# Altium project Commutator_DWS.PrjPcb
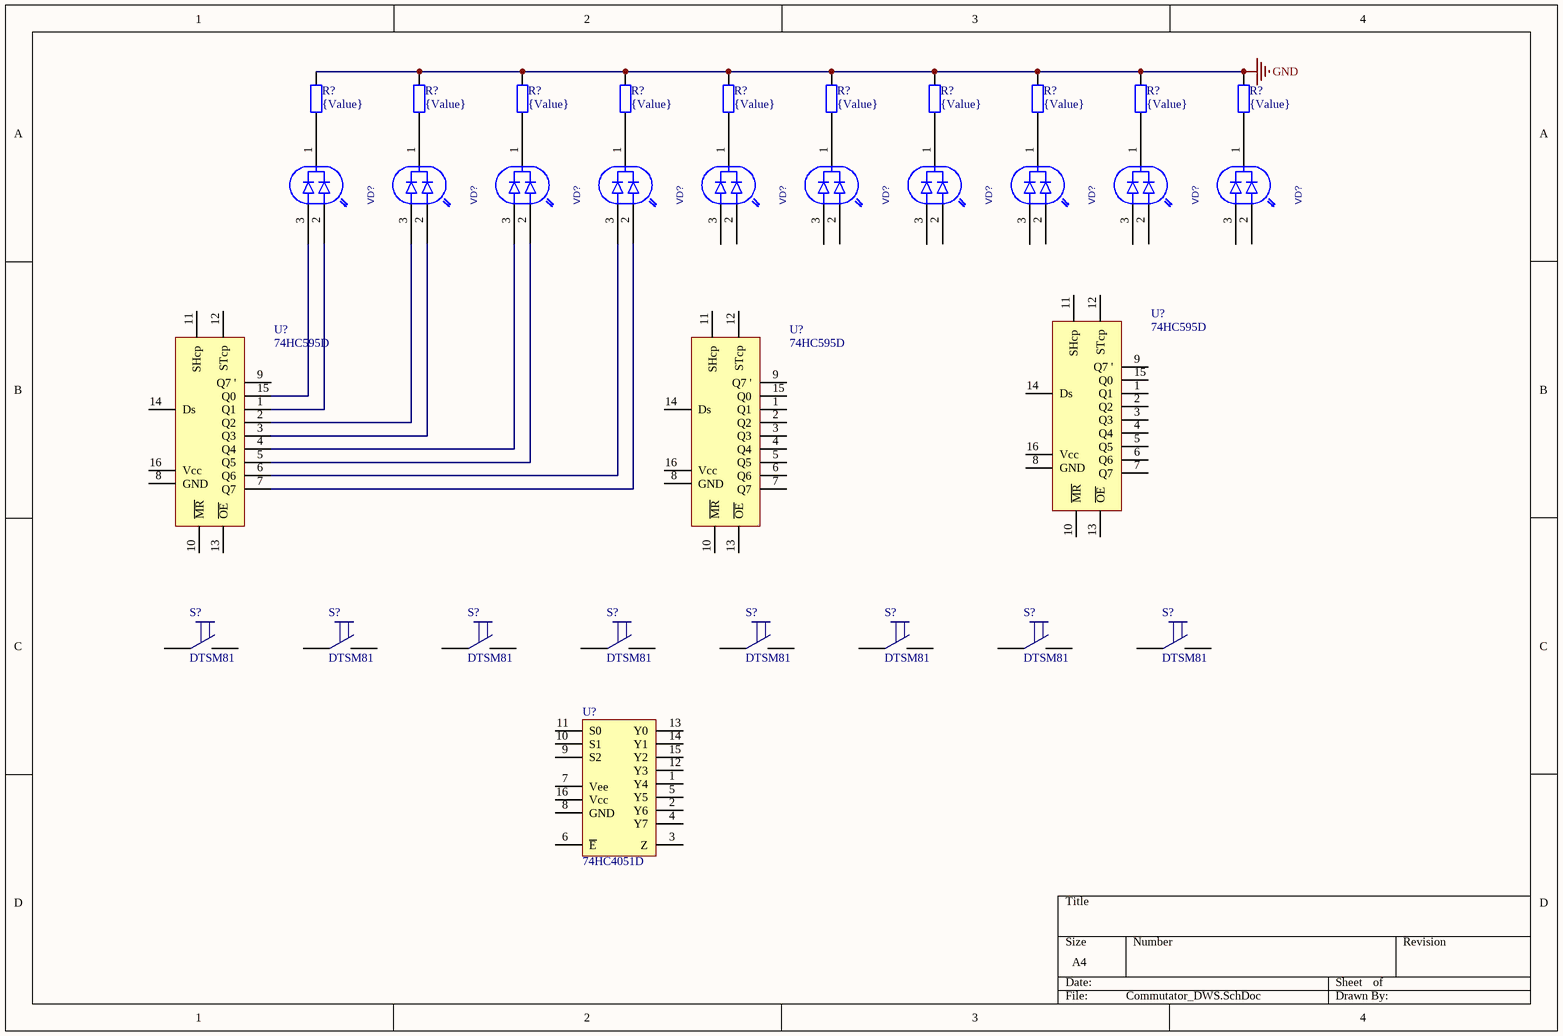
[diagram p0: Commutator_DWS.SchDoc]
1 sheet, 32 parts. Net scope: global (net labels, ports and power ports of the same name join across sheets).

## Sheet Commutator_DWS.SchDoc
size A4

### Parts
(Parts that share a designator on the sheet are numbered #1, #2 ... from top to bottom, then left to right.)
R?#1  value {Value}  [C0805]  (hidden comment: RES)
R?#2  value {Value}  [C0805]  (hidden comment: RES)
R?#3  value {Value}  [C0805]  (hidden comment: RES)
R?#4  value {Value}  [C0805]  (hidden comment: RES)
R?#5  value {Value}  [C0805]  (hidden comment: RES)
R?#6  value {Value}  [C0805]  (hidden comment: RES)
R?#7  value {Value}  [C0805]  (hidden comment: RES)
R?#8  value {Value}  [C0805]  (hidden comment: RES)
R?#9  value {Value}  [C0805]  (hidden comment: RES)
R?#10  value {Value}  [C0805]  (hidden comment: RES)
S?#1  DTSM81  [DTSM81]
S?#2  DTSM81  [DTSM81]
S?#3  DTSM81  [DTSM81]
S?#4  DTSM81  [DTSM81]
S?#5  DTSM81  [DTSM81]
S?#6  DTSM81  [DTSM81]
S?#7  DTSM81  [DTSM81]
S?#8  DTSM81  [DTSM81]
U?#1  74HC595D  [SO-16]
U?#2  74HC595D  [SO-16]
U?#3  74HC595D  [SO-16]
U?#4  74HC4051D  [SO-16]
VD?#1  LIGHTDIODE2  [LIGHTDIODE2]  (value not drawn)
VD?#2  LIGHTDIODE2  [LIGHTDIODE2]  (value not drawn)
VD?#3  LIGHTDIODE2  [LIGHTDIODE2]  (value not drawn)
VD?#4  LIGHTDIODE2  [LIGHTDIODE2]  (value not drawn)
VD?#5  LIGHTDIODE2  [LIGHTDIODE2]  (value not drawn)
VD?#6  LIGHTDIODE2  [LIGHTDIODE2]  (value not drawn)
VD?#7  LIGHTDIODE2  [LIGHTDIODE2]  (value not drawn)
VD?#8  LIGHTDIODE2  [LIGHTDIODE2]  (value not drawn)
VD?#9  LIGHTDIODE2  [LIGHTDIODE2]  (value not drawn)
VD?#10  LIGHTDIODE2  [LIGHTDIODE2]  (value not drawn)

### Nets
GND: R?#1.2 R?#2.2 R?#3.2 R?#4.2 R?#5.2 R?#6.2 R?#7.2 R?#8.2 R?#9.2 R?#10.2
NetR?#1_1: R?#1.1 VD?#1.1
NetR?#2_1: R?#2.1 VD?#2.1
NetR?#3_1: R?#3.1 VD?#3.1
NetR?#4_1: R?#4.1 VD?#4.1
NetR?#5_1: R?#5.1 VD?#5.1
NetR?#6_1: R?#6.1 VD?#6.1
NetR?#7_1: R?#7.1 VD?#7.1
NetR?#8_1: R?#8.1 VD?#8.1
NetR?#9_1: R?#9.1 VD?#9.1
NetR?#10_1: R?#10.1 VD?#10.1
NetU?#2_1: U?#2.1(Q1) VD?#1.2
NetU?#2_2: U?#2.2(Q2) VD?#2.3
NetU?#2_3: U?#2.3(Q3) VD?#2.2
NetU?#2_4: U?#2.4(Q4) VD?#3.3
NetU?#2_5: U?#2.5(Q5) VD?#3.2
NetU?#2_6: U?#2.6(Q6) VD?#4.3
NetU?#2_7: U?#2.7(Q7) VD?#4.2
NetU?#2_15: U?#2.15(Q0) VD?#1.3

Not connected (* = marked no-connect by the designer): S?#1 1 2; S?#2 1 2; S?#3 1 2; S?#4 1 2; S?#5 1 2; S?#6 1 2; S?#7 1 2; S?#8 1 2; U?#1 1(Q1) 2(Q2) 3(Q3) 4(Q4) 5(Q5) 6(Q6) 7(Q7) 8(GND) 9(Q7_') 10(~{MR}) 11(SHcp) 12(STcp) 13(~{OE}) 14(Ds) 15(Q0) 16(Vcc); U?#2 8(GND) 9(Q7_') 10(~{MR}) 11(SHcp) 12(STcp) 13(~{OE}) 14(Ds) 16(Vcc); U?#3 1(Q1) 2(Q2) 3(Q3) 4(Q4) 5(Q5) 6(Q6) 7(Q7) 8(GND) 9(Q7_') 10(~{MR}) 11(SHcp) 12(STcp) 13(~{OE}) 14(Ds) 15(Q0) 16(Vcc); U?#4 1(Y4) 2(Y6) 3(Z) 4(Y7) 5(Y5) 6(~{E}) 7(Vee) 8(GND) 9(S2) 10(S1) 11(S0) 12(Y3) 13(Y0) 14(Y1) 15(Y2) 16(Vcc); VD?#5 2 3; VD?#6 2 3; VD?#7 2 3; VD?#8 2 3; VD?#9 2 3; VD?#10 2 3

### Library data of the parts
R?#1-R?#10 = RES: Resistor
U?#1-U?#3 = 74HC595
U?#4 = 74HC4051
VD?#1-VD?#10 = LIGHTDIODE2: Value: *